# Altium schematic sheet FET_Driver_Shunts.SchDoc
size A4; SheetNumber: 4; SheetTotal: 5
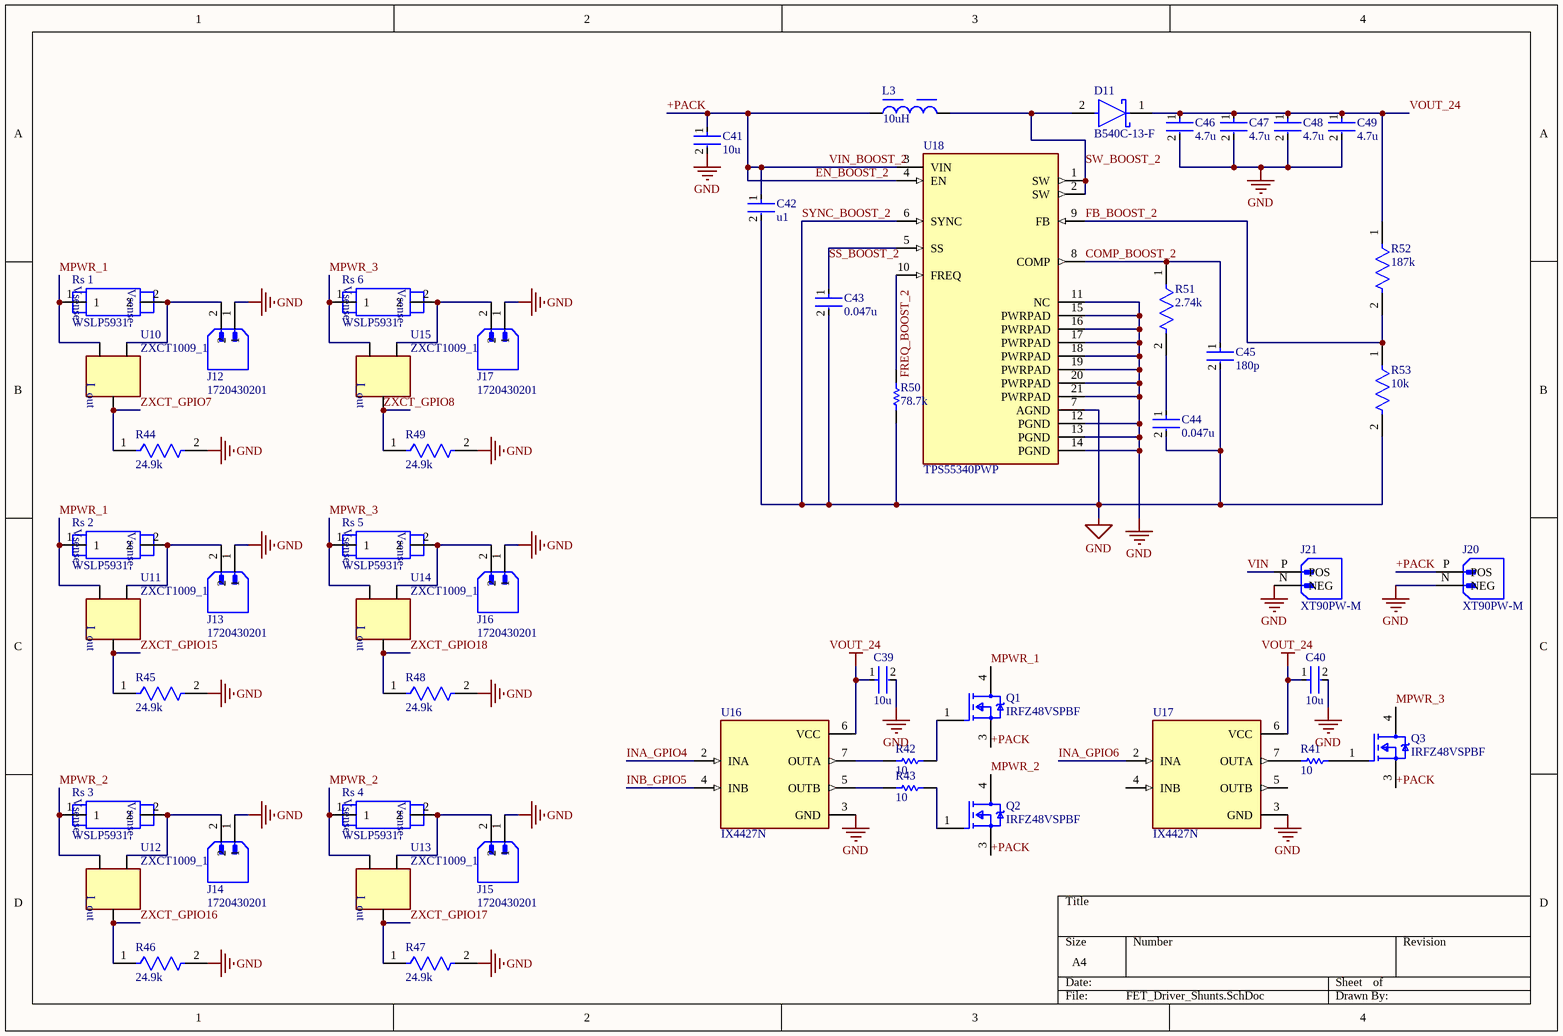
[diagram p0: FET_Driver_Shunts.SchDoc]

## Parts
C39  10u  [FP-GRM21B-0_2-e0_2_0_7-MFG]
C40  10u  [FP-GRM21B-0_2-e0_2_0_7-MFG]
C41  10u  [FP-GRM21B-0_2-e0_2_0_7-MFG]
C42  u1  [FP-CC0805-0_85-MFG]
C43  0.047u  [FP-C0805C-DN-MFG]
C44  0.047u  [FP-C0805C-DN-MFG]
C45  180p  [FP-C0805C-DN-MFG]
C46  4.7u  [FP-GRM32-MFG]
C47  4.7u  [FP-GRM32-MFG]
C48  4.7u  [FP-GRM32-MFG]
C49  4.7u  [FP-GRM32-MFG]
D11  B540C-13-F  [FP-SMC-MFG]
J12  1720430201  [MOLEX_1720430201]
J13  1720430201  [MOLEX_1720430201]
J14  1720430201  [MOLEX_1720430201]
J15  1720430201  [MOLEX_1720430201]
J16  1720430201  [MOLEX_1720430201]
J17  1720430201  [MOLEX_1720430201]
J20  XT90PW-M  [AMASS_XT90PW-M]
J21  XT90PW-M  [AMASS_XT90PW-M]
L3  10uH  [WE-LHMI_1040]
Q1  IRFZ48VSPBF  [FP-IRFZ48VSPBF-MFG]
Q2  IRFZ48VSPBF  [FP-IRFZ48VSPBF-MFG]
Q3  IRFZ48VSPBF  [FP-IRFZ48VSPBF-MFG]
R41  10  [RESC2013X50X30NL20T20]
R42  10  [RESC2013X50X30NL20T20]
R43  10  [RESC2013X50X30NL20T20]
R44  24.9k  [FP-RMCF0805-IPC_A]
R45  24.9k  [FP-RMCF0805-IPC_A]
R46  24.9k  [FP-RMCF0805-IPC_A]
R47  24.9k  [FP-RMCF0805-IPC_A]
R48  24.9k  [FP-RMCF0805-IPC_A]
R49  24.9k  [FP-RMCF0805-IPC_A]
R50  78.7k  [RESC1608X55X30ML15T15]
R51  2.74k  [FP-CR0805-IPC_A]
R52  187k  [FP-ERJ3EK-MFG]
R53  10k  [FP-ERA3A-IPC_C]
Rs_1  WSLP5931  [VISHAY_WSLP5931]
Rs_2  WSLP5931  [VISHAY_WSLP5931]
Rs_3  WSLP5931  [VISHAY_WSLP5931]
Rs_4  WSLP5931  [VISHAY_WSLP5931]
Rs_5  WSLP5931  [VISHAY_WSLP5931]
Rs_6  WSLP5931  [VISHAY_WSLP5931]
U10  ZXCT1009_1  [SOT23]
U11  ZXCT1009_1  [SOT23]
U12  ZXCT1009_1  [SOT23]
U13  ZXCT1009_1  [SOT23]
U14  ZXCT1009_1  [SOT23]
U15  ZXCT1009_1  [SOT23]
U16  IX4427N  [SOIC127P600X175-8N - duplicate]
U17  IX4427N  [SOIC127P600X175-8N - duplicate]
U18  TPS55340PWP  [IC_TPS55340PWP]

## Nets
SYNC_BOOST_2: C39.2 C40.2 C41.2 C42.2 C43.2 C44.2 C45.2 C46.2 C47.2 C48.2 C49.2 J12.1 J13.1 J14.1 J15.1 J16.1 J17.1 J20.N(NEG) J21.N(NEG) R44.2 R45.2 R46.2 R47.2 R48.2 R49.2 R50.1 R53.2 U16.3(GND) U17.3(GND) U18.6(SYNC) U18.7(AGND) U18.11(NC) U18.12(PGND) U18.13(PGND) U18.14(PGND) U18.15(PWRPAD) U18.16(PWRPAD) U18.17(PWRPAD) U18.18(PWRPAD) U18.19(PWRPAD) U18.20(PWRPAD) U18.21(PWRPAD)  [also labelled GND]
VOUT_24: C39.1 C40.1 C46.1 C47.1 C48.1 C49.1 D11.1(C) R52.1 U16.6(VCC) U17.6(VCC)
+PACK: C41.1 C42.1 J20.P(POS) L3.1 Q1.3(SOURCE) Q2.3(SOURCE) Q3.3(SOURCE) U18.3(VIN) U18.4(EN)  [also labelled EN_BOOST_2, VIN_BOOST_2]
COMP_BOOST_2: C45.1 R51.1 U18.8(COMP)
FB_BOOST_2: R52.2 R53.1 U18.9(FB)
FREQ_BOOST_2: R50.2 U18.10(FREQ)
INA_GPIO4: U16.2(INA)
INA_GPIO6: U17.2(INA)
INB_GPIO5: U16.4(INB)
MPWR_1: Q1.4(DRAIN) Rs_1.1 Rs_2.1 U10.1(VSENSE+) U11.1(VSENSE+)
MPWR_2: Q2.4(DRAIN) Rs_3.1 Rs_4.1 U12.1(VSENSE+) U13.1(VSENSE+)
MPWR_3: Q3.4(DRAIN) Rs_5.1 Rs_6.1 U14.1(VSENSE+) U15.1(VSENSE+)
SS_BOOST_2: C43.1 U18.5(SS)
SW_BOOST_2: D11.2(A) L3.2 U18.1(SW) U18.2(SW)
VIN: J21.P(POS)
ZXCT_GPIO7: R44.1 U10.3(IOUT)
ZXCT_GPIO8: R49.1 U15.3(IOUT)
ZXCT_GPIO15: R45.1 U11.3(IOUT)
ZXCT_GPIO16: R46.1 U12.3(IOUT)
ZXCT_GPIO17: R47.1 U13.3(IOUT)
ZXCT_GPIO18: R48.1 U14.3(IOUT)
NetC44_1: C44.1 R51.2
NetJ12_2: J12.2 Rs_1.2 U10.2(VSENSE-)
NetJ13_2: J13.2 Rs_2.2 U11.2(VSENSE-)
NetJ14_2: J14.2 Rs_3.2 U12.2(VSENSE-)
NetJ15_2: J15.2 Rs_4.2 U13.2(VSENSE-)
NetJ16_2: J16.2 Rs_5.2 U14.2(VSENSE-)
NetJ17_2: J17.2 Rs_6.2 U15.2(VSENSE-)
NetQ1_1: Q1.1(GATE) R42.2
NetQ2_1: Q2.1(GATE) R43.2
NetQ3_1: Q3.1(GATE) R41.2
NetR41_1: R41.1 U17.7(OUTA)
NetR42_1: R42.1 U16.7(OUTA)
NetR43_1: R43.1 U16.5(OUTB)

Not connected (* = marked no-connect by the designer): U17 4(INB) 5(OUTB)

## Notes on the sheet
- (in symbol ZXCT1009_1) Vsense+; Vsense-; I_out

## Library data of the parts
C39-C41 = CMP-06035-044754-1: GRM21BR61H106ME43L                       Chip Multilayer Ceramic Capacitors for General Purpose, 0805, 10uF, X5R, 15%, 20%, 50V
C42 = CMP-2100-03606-3: CC0805KRX7R9BB104 CAP CER 0.1UF 50V X7R 0805; Manufacturer: Yageo; Tolerance: 0.1; Capacitance: 100 nF; Value: 100 nF; Material: Ceramic; Device Class L1: Passive Components; ComponentLink2Description: Datasheet; Package: CC0805-0.85; Manufacturer Part Number: CC0805KRX7R9BB104; Digikey Description: CAP CER 0.1UF 50V X7R 0805; Device Class L3: Ceramic Capacitors; Temperature: -30°C to +85°C; Temperature Characteristic: X7R; Voltage Rating: 50 V; Height: 0.95mm; RoHS: TRUE; Ipc Land Pattern Name: CAPC200125X85; Device Class L2: Capacitors; Category: Cap; Temperature Range Low: -30°C; Temperature Range High: +85°C; Mouser Description: Multilayer Ceramic Capacitors MLCC - SMD/SMT 100nF 50V X7R 10%; Footprint Url: http://www.yageo.com/exep/pages/download/literatures/UPY-C_GEN_24.pdf; Automotive: No; Octopart: https://octopart.com/cc0805krx7r9bb104-yageo-192993; Lead Free: Yes; ComponentLink2URL: http://www.yageo.com/documents/recent/UPY-GPHC_Y5V_6.3V-to-50V_8.pdf
C43 C44 = CMP-2007-01098-2: C0805C473K5RACTU  CAP CER 0.047UF 50V X7R 0805; Manufacturer: KEMET; Value: 47,000 pF; Material: Ceramic; Tolerance: 0.1; Description: C0805 47,000 pF X7R 30ppm/°C 10.00% 50 V; Temperature Coefficient: 30ppm/°C; Ipc Land Pattern Name: CAPC200125X78; ComponentLink2URL: https://content.kemet.com/datasheets/KEM_C1003_C0G_SMD.pdf; Manufacturer Part Number: C0805C473K5RACTU; ComponentLink2Description: Datasheet; Voltage Rating: 50 V; Device Class L3: Ceramic Capacitors; Temperature Range High: +125°C; Temperature: -55°C to +125°C; RoHS: TRUE; Capacitance: 47,000 pF; Digikey Description: CAP CER 0.047UF 50V X7R 0805; Octopart: https://octopart.com/c0805c473k5ractu-kemet-138387; Temperature Range Low: -55°C; Height: 0.88mm; Lead Free: Yes; Temperature Characteristic: X7R; Mouser Description: Capacitor; Ceramic; Cap 0.047 uF; Tol 10%; Vol-Rtg 50 VDC; SMT; 0805; X7R; Tape&Reel; Automotive: No; Device Class L1: Passive Components; Device Class L2: Capacitors; Package: C0805C-DN; Category: Cap
C45 = CMP-2007-00307-2: CAP CER 180PF 50V C0G/NP0 0805; Manufacturer: KEMET; Manufacturer Part Number: C0805C181J5GACTU; Temperature Characteristic: C0G; Temperature Coefficient: 30ppm/°C; Tolerance: 0.05; Material: Ceramic; ComponentLink2Description: Datasheet; Automotive: No; Value: 180 pF; Temperature Range High: +125°C; Digikey Description: CAP CER 180PF 50V C0G/NP0 0805; Octopart: https://octopart.com/c0805c181j5gactu-kemet-108653; Device Class L2: Capacitors; ComponentLink2URL: https://content.kemet.com/datasheets/KEM_C1003_C0G_SMD.pdf; RoHS: TRUE; Device Class L3: Ceramic Capacitors; Voltage Rating: 50 V; Lead Free: Yes; Package: C0805C-DN; Temperature Range Low: -55°C; Capacitance: 180 pF; Ipc Land Pattern Name: CAPC200125X78; Mouser Description: Multilayer Ceramic Capacitors MLCC - SMD/SMT 50volts 180pF C0G 5%; Temperature: -55°C to +125°C; Category: Cap; Height: 0.88mm; Device Class L1: Passive Components
C46-C49 = CMP-1038-02162-3: CAP CER 4.7UF 50V X7R 1210; Manufacturer: Murata; Manufacturer Part Number: GRM32ER71H475KA88L; Tolerance: 10%; Temperature Coefficient: 15%; Material: Ceramic; Lead Free: Yes; Value: 4.7uF; ComponentLink2Description: Datasheet; Capacitance: 4.7uF; Digikey Description: CAP CER 4.7UF 50V X7R 1210; Category: Cap; Automotive: No; ComponentLink2URL: https://search.murata.co.jp/Ceramy/image/img/A01X/G101/ENG/GRM32ER71H475KA88-01A.pdf; Package: GRM32; Device Class L2: Capacitors; Voltage Rating: 50V; Device Class L1: Passive Components; Mouser Description: Capacitor Capacitance tolerance: ±10% Ceramic type: X7R Construction form: 1210 Capacitance: 4.7 µF Rated voltage: 50...; Octopart: https://octopart.com/grm32er71h475ka88l-murata-196576; Temperature: -55°C to +125°C; Temperature Range Low: -55°C; Height: 2.7mm; Temperature Characteristic: X7R; Temperature Range High: +125°C; RoHS: TRUE; Device Class L3: Ceramic Capacitors
D11 = CMP-2000-05097-3: DIODE SCHOTTKY 40V 5A SMC; Manufacturer: Diodes Inc.; Automotive Grade: NA; Peak Reverse Current: 0.5mA; Value: 300pF; Max Junction Temp: +150°C; Max Surge Forward Current: 100A; Standoff Height: 0.1mm; Digikey Description: DIODE SCHOTTKY 40V 5A SMC; Temperature Range Low: -55°C; Manufacturer Part Number: B540C-13-F; Octopart: https://octopart.com/b540c-13-f-diodes+inc.-325873; Lead Free: Yes; Reverse Voltage: 40V; RoHS: TRUE; Category: Diode; Mouser Description: Diode: Schottky rectifying; SMD; 40V; 5A; SMC; Package: reel, tape; ComponentLink2Description: Datasheet; Temperature Range High: +150°C; Automotive: No; Footprint Url: https://www.diodes.com/assets/Package-Files/SMC.pdf; Device Class L3: Schottky Diodes; Height: 2.5mm; Forward Current: 5A; Temperature: -55°C to +150°C; Package: SMC; ComponentLink2URL: https://www.diodes.com/assets/Datasheets/ds13012.pdf; Device Class L2: Diodes; Max Repetitive Reverse Voltage: 40V; Device Class L1: Discrete Semiconductors; Capacitance: 300pF
J20 J21 = XT90PW-M: Socket; DC supply; XT90; male; PIN: 2; on PCBs; THT; Colour: yellow; MF: AMASS; SnapEDA_Link: https://www.snapeda.com/parts/XT90PW-M/AMASS/view-part/?ref=snap; Package: Package; Value: *; MP: XT90PW-M; Check_prices: https://www.snapeda.com/parts/XT90PW-M/AMASS/view-part/?ref=eda
L3 = CMP-1353-00006-5: NexarPartId: 22866671; Core Material: Composite, Ferrite; Series Resistance: 30mΩ; Test Frequency: 100kHz; Self Resonant Frequency: 12MHz; Max DC Current: 5.2A; Inductance Tolerance: 20%; Inductance: 10µH; Shielding: Shielded; DC Resistance (DCR): 27mΩ; Saturation Current: 7.9A; Width: 10mm; Min Operating Temperature: -40°C; Height: 3.8mm; RoHS: Compliant; Depth: 10mm; Mount: Surface Mount; Case/Package: Nonstandard; Height - Seated (Max): 3.9878mm; Packaging: Digi-Reel®; Tolerance: 20%; REACH SVHC: Unknown; Max Operating Temperature: 125°C; Ambient Temperature Range Low: -40°C; Ambient Temperature Range High: 85°C; Length: 11mm; Composition: Wirewound; Termination: SMD/SMT; RMS Current (Irms): 5.2A; Current Rating: 5.2A; Frequency: 12MHz
Q1-Q3 = CMP-32901-000861-1: MOSFET N-CH 60V 72A D2PAK; Gate to Source Voltage (Vgs): 20V; Turn-Off Delay Time: 157ns; Polarization: N; Threshold Voltage: 4V; Power Dissipation: 150W; Drain to Source Resistance: 12mR; Turn-On Delay Time: 7.6ns; Element Configuration: Single; Mount: Surface Mount; Min Operating Temperature: -55°C; Case/Package: D2PAK; Length: 0.42inch; Continuous Drain Current (ID): 72A; Max Operating Temperature: 175°C; Number of Pins: 3; Drain to Source Voltage (Vdss): 60V; Lead Free: Contains Lead; REACH SVHC: No SVHC; Width: 0.38inch; Max Dual Supply Voltage: 60V; RoHS Compliant: Yes; Height: 0.185inch; Max Power Dissipation: 150W; Halogen Free: Halogen Free; Drain to Source Breakdown Voltage: 60V
R41-R43 = CMP-2001-04915-1: CRCW080510R0FKEA; Manufacturer: Vishay Dale; Part Number: CRCW080510R0FKEA
R44 = CMP-26527-006885-1: RMCF0805FT24K9  24.9kΩ ±1% 0.125W 0805 Thick Film Chip Resistor AEC-Q200 compliant; Temperature Coefficient: 100ppm/°C; Power Rating: 125mW; Resistance: 24.9kR; Military Standard: Not; Mount: Surface Mount; Contact Plating: Tin; Min Operating Temperature: -55°C; Length: 0.079inch; Size Code: 0805; Resistor Type: Thick Film; Depth: 1.25mm; Max Power Dissipation: 125mW; Series: RMCF; Features: Automotive AEC-Q200; Width: 0.049inch; Lead Free: Lead Free; Tolerance: 1%; Case Code (Imperial): 0805; Radiation Hardening: No; Max Operating Temperature: 155°C; Height: 0.026inch; Case Code (Metric): 2012; RoHS Compliant: Yes; Number of Terminations: 2; Packaging: Tape and Reel; Construction: Rectangular; Case/Package: 0805
R45-R49 = CMP-26527-006885-1: RMCF0805FT24K9  24.9kΩ ±1% 0.125W 0805 Thick Film Chip Resistor AEC-Q200; Temperature Coefficient: 100ppm/°C; Power Rating: 125mW; Resistance: 24.9kR; Military Standard: Not; Mount: Surface Mount; Contact Plating: Tin; Min Operating Temperature: -55°C; Length: 0.079inch; Size Code: 0805; Resistor Type: Thick Film; Depth: 1.25mm; Max Power Dissipation: 125mW; Series: RMCF; Features: Automotive AEC-Q200; Width: 0.049inch; Lead Free: Lead Free; Tolerance: 1%; Case Code (Imperial): 0805; Radiation Hardening: No; Max Operating Temperature: 155°C; Height: 0.026inch; Case Code (Metric): 2012; RoHS Compliant: Yes; Number of Terminations: 2; Packaging: Tape and Reel; Construction: Rectangular; Case/Package: 0805
R50 = CMP-2000-00646-1: Part Number: ERJ-3EKF7872V; Manufacturer: Panasonic
R51 = CMP-07231-003311-1: Thick Film Chip Resistors 0805 2.74kΩ 0.125W 1% 100ppm/°C; Voltage Rating: 150V; Power Rating: 125mW; Resistance: 2.74kR; Case/Package: 0805; Package Quantity: 5000; Tolerance: 1%; Thickness: 508um; Mount: Surface Mount; Width: 1.25mm; Depth: 1.25mm; Radiation Hardening: No; Case Code (Metric): 2012; Termination: SMD/SMT; Composition: Thick Film; Length: 2mm; Temperature Coefficient: 100ppm/°C; Contact Plating: Tin; Case Code (Imperial): 0805; Features: Moisture Resistant; Height: 0.024inch; Min Operating Temperature: -55°C; Packaging: Tape and Reel; Max Operating Temperature: 155°C; Military Standard: Not; Max Power Dissipation: 125mW; Number of Terminations: 2
R52 = CMP-2000-00305-2: RES SMD 187K OHM 1% 1/10W 0603; Temperature Coefficient: 100ppm/°C; Max Power Dissipation: 100mW; Voltage Rating (DC): 50V; Resistance: 187kR; Voltage Rating: 75V; Packaging: Tape and Reel; Height: 0.45mm; Mount: Surface Mount; Min Operating Temperature: -55°C; Contact Plating: Tin; Radiation Hardening: No; Case/Package: 0603; Technology: THICK FILM; Resistor Type: Thick Film; Features: Automotive AEC-Q200; Length: 1.6mm; REACH SVHC: Yes; Construction: Rectangular; Max Operating Temperature: 155°C; Military Standard: Not; Case Code (Imperial): 0603; RoHS Compliant: Yes; Package Quantity: 1; Power Rating: 100mW; Termination: SMD/SMT; Resistance Tolerance: 1%; Number of Terminations: 2; Case Code (Metric): 1608; Depth: 0.8mm; Series: ERJ; Tolerance: 1%; Width: 0.8mm; Lead Free: Lead Free
R53 = CMP-2000-00874-2: RES SMD 10K OHM 0.1% 1/10W 0603; Voltage Rating (DC): 75V; Power Rating: 100mW; Resistance: 10kR; Temperature Coefficient: 25ppm/°C; Radiation Hardening: No; Width: 0.8mm; Depth: 0.8mm; Construction: Rectangular; Case Code (Metric): 1608; Package Quantity: 5000; Length: 1.6mm; Size Code: 0603; Case Code (Imperial): 0603; Termination: SMD/SMT; Contact Plating: Tin; Resistance Tolerance: 0.1%; Military Standard: Not; Packaging: Tape and Reel; Max Power Dissipation: 100mW; REACH SVHC: No SVHC; Series: ERA-3A; Voltage Rating: 75V; Lead Free: Lead Free; Technology: METAL FILM; RoHS Compliant: Yes; Max Operating Temperature: 155°C; Resistor Type: Thin Film; Min Operating Temperature: -55°C; Number of Pins: 2; Case/Package: 0603; Tolerance: 0.1%; Height: 0.45mm; Mount: Surface Mount; Number of Terminations: 2
Rs_1-Rs_4 Rs_6 = WSLP5931: 0.0001 ohms        Chip Resistor Nonstandard Anti-Sulfur, Automotive AEC-Q200, Current Sense, Moisture Resistant, Pulse Withstanding Metal Element; MP: WSLP59313L000FEB; MF: Vishay Dale; Price: None; Package: 5931 Vishay Dale; Value: *; Availability: Unavailable; SnapEDA_Link: https://www.snapeda.com/parts/WSLP59313L000FEB/Vishay%20Dale/view-part/229340/?ref=snap
Rs_5 = WSLP5931: 0.0001 ohms        Chip Resistor Nonstandard Anti-Sulfur, Automotive AEC-Q200, Current Sense, Moisture Resistant, Pulse Withstanding Metal ElementResistant, Pulse Withstanding Metal Element; MP: WSLP59313L000FEB; MF: Vishay Dale; Price: None; Package: 5931 Vishay Dale; Value: *; Availability: Unavailable; SnapEDA_Link: https://www.snapeda.com/parts/WSLP59313L000FEB/Vishay%20Dale/view-part/229340/?ref=snap
U10-U15 = ZXCT1009_1: High Performance Current Monitor; MF: Diodes Zetex; SnapEDA_Link: https://www.snapeda.com/parts/ZXCT1009/Zetex/view-part/?ref=snap; Package: None; Value: *; MP: ZXCT1009; Check_prices: https://www.snapeda.com/parts/ZXCT1009/Zetex/view-part/?ref=eda
U16 U17 = IX4427N: Low-Side Gate Driver IC Non-Inverting 8-SOIC; MF: IXYS Integrated; Value: *; MP: IX4427N; Package: SOIC-8 IXYS; Availability: Good; DigiKey-Purchase-URL: https://snapeda.com/shop?store=DigiKey&id=610744; Price: None; SnapEDA_Link: https://www.snapeda.com/parts/IX4427N/IXYS%20Integrated%20Circuits%20Division/view-part/610744/?ref=snap; Mouser-Purchase-URL: https://snapeda.com/shop?store=Mouser&id=610744; Arrow_Electronics-Purchase-URL: https://snapeda.com/shop?store=Arrow+Electronics&id=610744
U18 = TPS55340PWP: Integrated, 5-A 40-V Wide Input Range Boost/SEPIC/Flyback DC-DC Regulator 14-HTSSOP -40 to 150; MF: Texas Instruments; Check_prices: https://www.snapeda.com/parts/TPS55340PWP/Texas+Instruments/view-part/?ref=eda; Price: None; SnapEDA_Link: https://www.snapeda.com/parts/TPS55340PWP/Texas+Instruments/view-part/?ref=snap; MP: TPS55340PWP; Value: *; Availability: In Stock; Package: HTSSOP-14 Texas Instruments; Purchase-URL: https://pricing.snapeda.com/search/part/TPS55340PWP/?ref=eda; Supplier 1: Digikey; Supplier Part Number 1: 296-35493-5-ND; Supplier 2: Mouser; Supplier Part Number 2: 595-TPS55340PWP
J12-J17 = 1720430201: Value: *; Price: None; Availability: Unavailable; Package: None; MP: 1720430201